# EAGLE schematic basic_tracker (EAGLE 6.2)
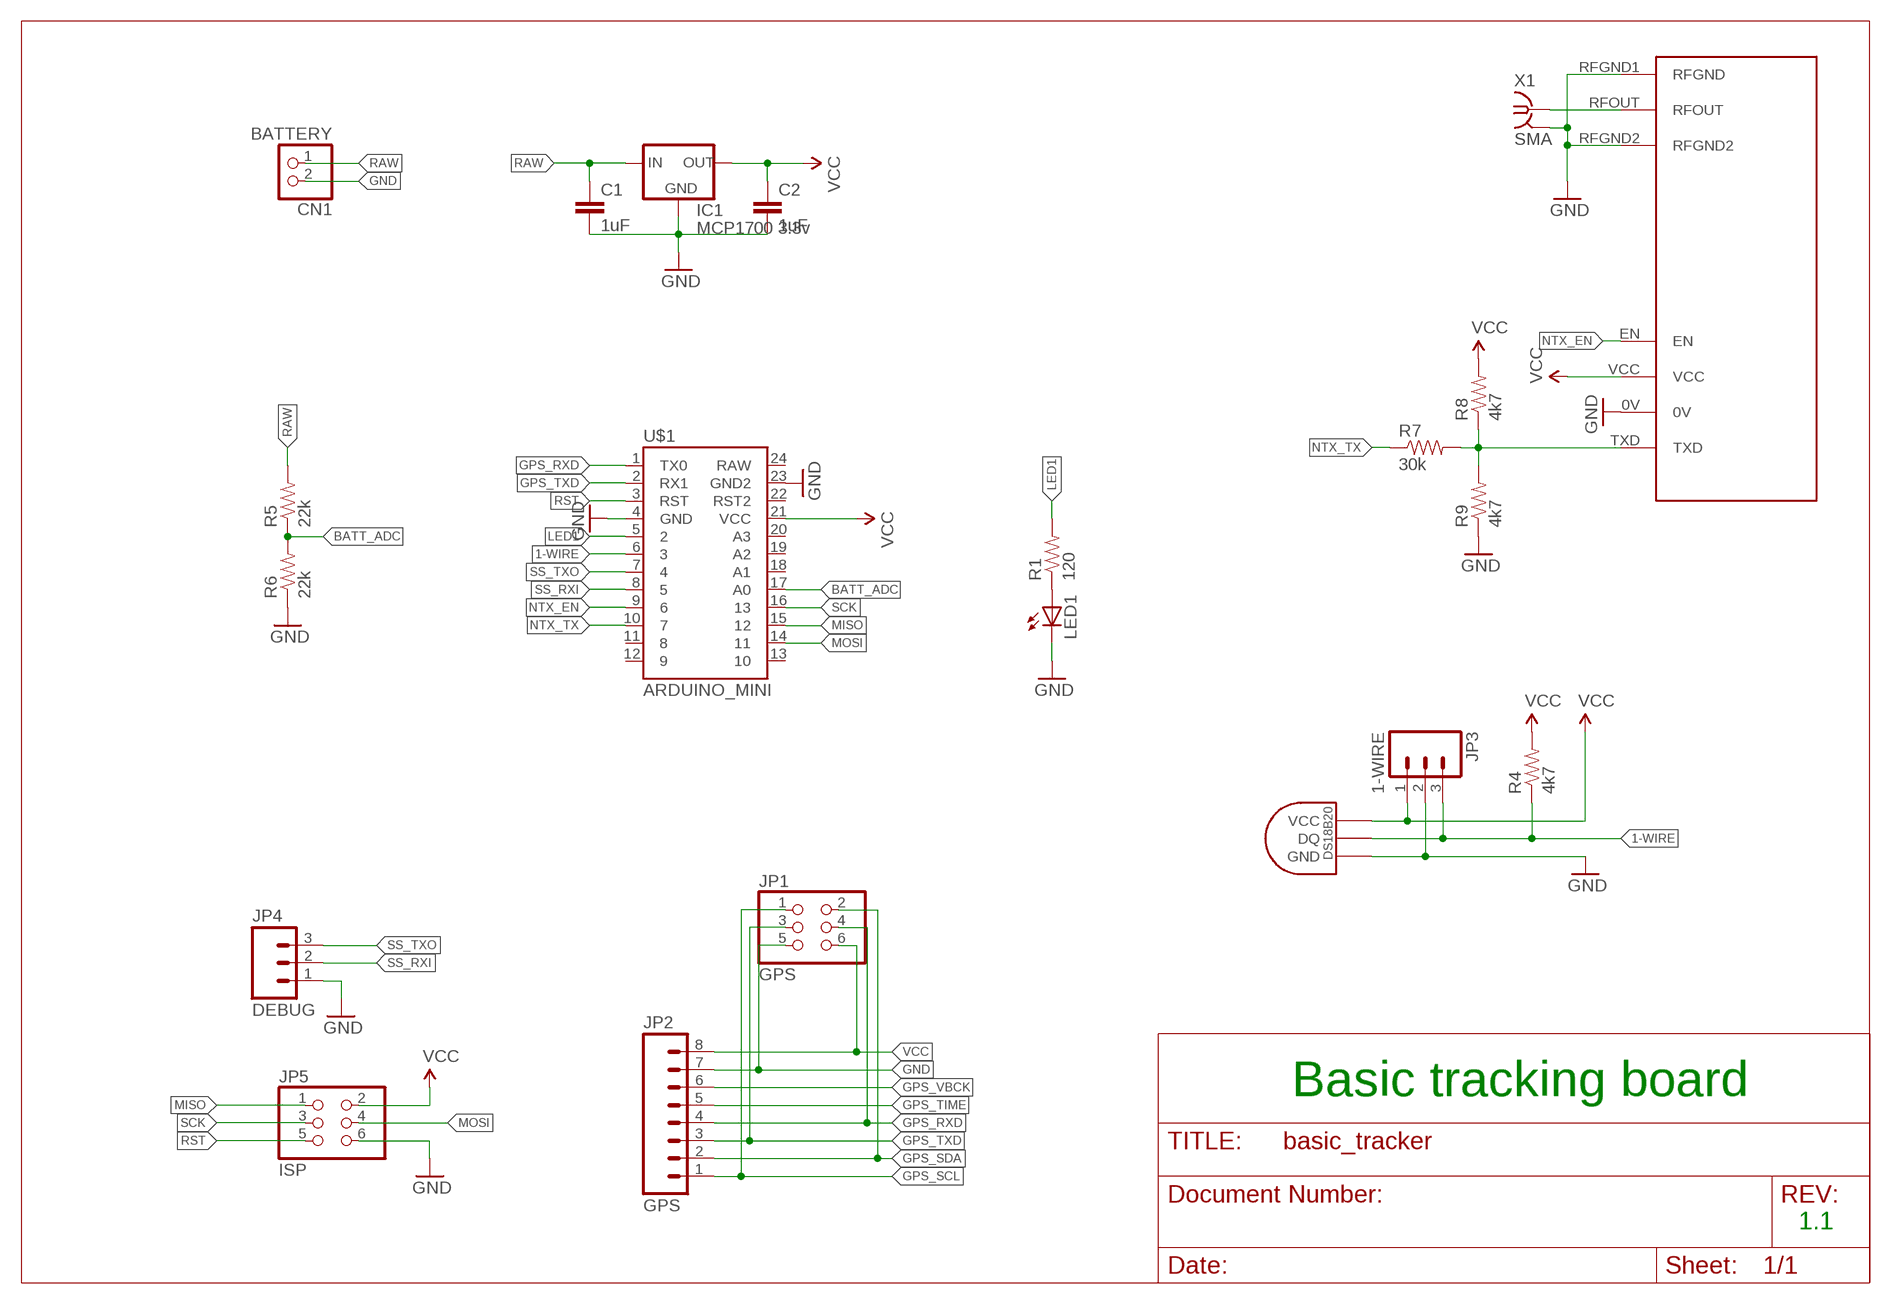
[diagram p0: schematic, sheet 1]

## Parts
C1  1uF  CAPPTH1  [CAP-PTH-5MM]
C2  1uF  CAPPTH1  [CAP-PTH-5MM]
CN1  BATTERY  JST_2PIN-THM-RA  [JST-PH-2-THM-RA]
IC1  MCP1700 3.3v  MCP1700INLINE  [TO92-INLINE]
JP1  GPS  PINHD-2X3  [2X03]
JP2  GPS  M081X08  [1X08]
JP3  1-WIRE  M03JST-PTH  [JST-3-PTH]
JP4  DEBUG  M03JST-PTH  [JST-3-PTH]
JP5  ISP  PINHD-2X3  [2X03]
LED1  LED3MM  [LED3MM]
R1  120  RESISTORAXIAL-0.3  [AXIAL-0.3]
R4  4k7  RESISTORAXIAL-0.3  [AXIAL-0.3]
R5  22k  RESISTORAXIAL-0.3  [AXIAL-0.3]
R6  22k  RESISTORAXIAL-0.3  [AXIAL-0.3]
R7  30k  RESISTORAXIAL-0.3  [AXIAL-0.3]
R8  4k7  RESISTORAXIAL-0.3  [AXIAL-0.3]
R9  4k7  RESISTORAXIAL-0.3  [AXIAL-0.3]
U$1  ARDUINO_MINI  [ARDUINO_MINI]
U$2  DS1820TO92  [DS1820]
U$3  NTX2-VERTICAL  [NTX2-VERTICAL]
X1  SMA  BU-SMA-H  [BU-SMA-H]

## Nets
1-WIRE: JP3.3 R4.P$1 U$1.6 U$2.DQ
BATT_ADC: R5.P$1 R6.P$2 U$1.17(A0)
GND: C1.2 C2.2 CN1.2 IC1.1(GND) JP1.5 JP2.7 JP3.2 JP4.1 JP5.6 LED1.K(C) R6.P$1 R9.P$1 U$1.4(GND) U$1.23(GND2) U$2.GND U$3.0V U$3.RFGND1(RFGND) U$3.RFGND2 X1.2(GND)
GPS_RXD: JP1.4 JP2.4 U$1.1(TX0)
GPS_SCL: JP1.1 JP2.1
GPS_SDA: JP1.2 JP2.2
GPS_TIME: JP2.5
GPS_TXD: JP1.3 JP2.3 U$1.2(RX1)
GPS_VBCK: JP2.6
LED1: R1.P$2 U$1.5
MISO: JP5.1 U$1.15
MOSI: JP5.4 U$1.14
N$1: LED1.A R1.P$1
N$4: U$3.RFOUT X1.1
N$6: R7.P$2 R8.P$1 R9.P$2 U$3.TXD
NTX_EN: U$1.9 U$3.EN
NTX_TX: R7.P$1 U$1.10
RAW: C1.1 CN1.1 IC1.2(IN) R5.P$2
RST: JP5.5 U$1.3(RST)
SCK: JP5.3 U$1.16
SS_RXI: JP4.2 U$1.8
SS_TXO: JP4.3 U$1.7
VCC: C2.1 IC1.3(OUT) JP1.6 JP2.8 JP3.1 JP5.2 R4.P$2 R8.P$2 U$1.21(VCC) U$2.VDD(VCC) U$3.VCC
Unconnected: U$1.11 U$1.12 U$1.13 U$1.18(A1) U$1.19(A2) U$1.20(A3) U$1.22(RST2) U$1.24(RAW)

## Notes on the sheet
- Basic tracking board
- 1.1

## Power pins joined to a net without a drawn wire
GND: X1.3(GND) X1.4(GND) X1.5(GND)

## Library data of the parts
C1 C2 = SparkFun:CAP: Capacitor Standard 0603 ceramic capacitor, and 0.1" leaded capacitor.
CN1 = adafruit:JST_2PIN: JST 2-Pin Connectors of various flavors SMT-RA (S2B-PH-SM4) 4UConnector #17311 SMT (B2B-PH-SM4) THM-RA (S2B-PH) THM (B2B-PH)
IC1 = adafruit:MCP1700: VOLTAGE REGULATOR
JP1 JP5 = SparkFun:PINHD-2X3: PIN HEADER
JP2 = SparkFun:M08: Header 8 Standard 8-pin 0.1" header. Use with straight break away headers (SKU : PRT-00116), right angle break away headers (PRT-00553), swiss pins (PRT-00743), machine pins (PRT-00117), and female headers (PRT-00115).
JP3 JP4 = SparkFun:M03: Header 3 Standard 3-pin 0.1" header. Use with straight break away headers (SKU : PRT-00116), right angle break away headers (PRT-00553), swiss pins (PRT-00743), machine pins (PRT-00117), and female headers (PRT-00115). Molex polarized connector foot print use with SKU : PRT-08232 with associated crimp pins and housings.
LED1 = SparkFun:LED: LEDs Standard schematic elements and footprints for 5mm, 3mm, 1206, and 0603 sized LEDs. 5mm - Spark Fun Electronics SKU : COM-00529 (and others)
R1 R4-R9 = SparkFun:RESISTOR: Resistor Basic schematic elements and footprints for 0603, 1206, and PTH resistors.
U$1 = SparkFun:ARDUINO_MINI
U$2 = Ava:DS1820: DS18B20 Programmable Resolution 1-Wire Digital Thermometer Description The DS18B20 digital thermometer provides 9-bit to 12-bit Celsius temperature measurements and has an alarm function with nonvolatile user-programmable upper and lower trigger points. The DS18B20 communicates over a 1-Wire® bus that by definition requires only one data line (and ground) for communication with a central microprocessor. It has an operating temperature range of -55°C to +125°C and is accurate to ±0.5°C over the range of -10°C to +85°C. In addition, the DS18B20 can derive power directly from the data line ("parasite power"), eliminating the need for an external power supply. Each DS18B20 has a unique 64-bit serial code, which allows multiple DS18B20s to function on the same 1-Wire bus. Thus, it is simple to use one microprocessor to control many DS18B20s distributed over a large area. Applications that can benefit from this feature include HVAC environmental controls, temperature monitoring systems inside buildings, equipment, or machinery, and process monitoring and control systems.
U$3 = Ava:NTX2-VERTICAL: Radiometrix NTX2 Transmitter Module Author Anthony Stirk / http://ava.upuaut.net
X1 = con-coax:BU-SMA-H: FEMALE SMA CONNECTOR Radiall; OC_FARNELL: unknown; OC_NEWARK: unknown